# Altium schematic sheet Sheet.Test.SchDoc
size A4
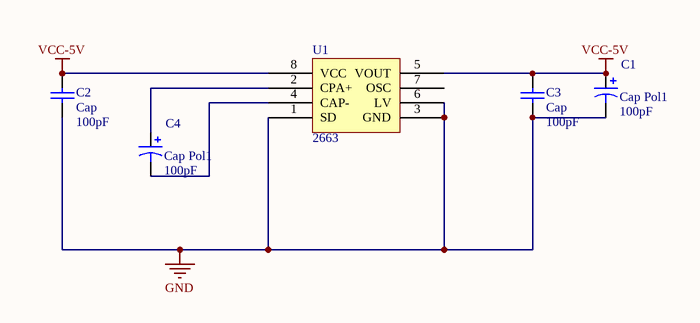
[diagram p0: Sheet.Test.SchDoc]

## Parts
C1  Cap Pol1  value 100pF  [RB7.6-15]
C2  Cap  value 100pF  [RAD-0.3]
C3  Cap  value 100pF  [RAD-0.3]
C4  Cap Pol1  value 100pF  [RB7.6-15]
U1  2663

## Nets
GND: C1.2 C2.2 C3.2 U1.1(SD) U1.3(GND) U1.6(LV)
VCC-5V: C1.1 C2.1 C3.1 U1.5(VOUT) U1.8(VCC)
NetC4_1: C4.1 U1.2(CPA+)
NetC4_2: C4.2 U1.4(CAP-)

Not connected (* = marked no-connect by the designer): U1 7(OSC)

## Library data of the parts
C1 C4 = Cap Pol1: Polarized Capacitor (Radial); Published: 8-Jun-2000; LatestRevisionDate: 17-Jul-2002; LatestRevisionNote: Re-released for DXP Platform.; PackageReference: RB7.6-15; Publisher: Altium Limited; PackageDescription: Polarized Capacitor (Radial); 2 Leads
C2 C3 = Cap: Capacitor; Published: 8-Jun-2000; LatestRevisionDate: 17-Jul-2002; LatestRevisionNote: Re-released for DXP Platform.; PackageReference: RAD-0.3; Publisher: Altium Limited; PackageDescription: Radial Cap, Thru-Hole; 2 Leads; 0.3 in Pin Spacing
U1 = LM2663